# Altium schematic sheet ResDivider.SchDoc
size A3
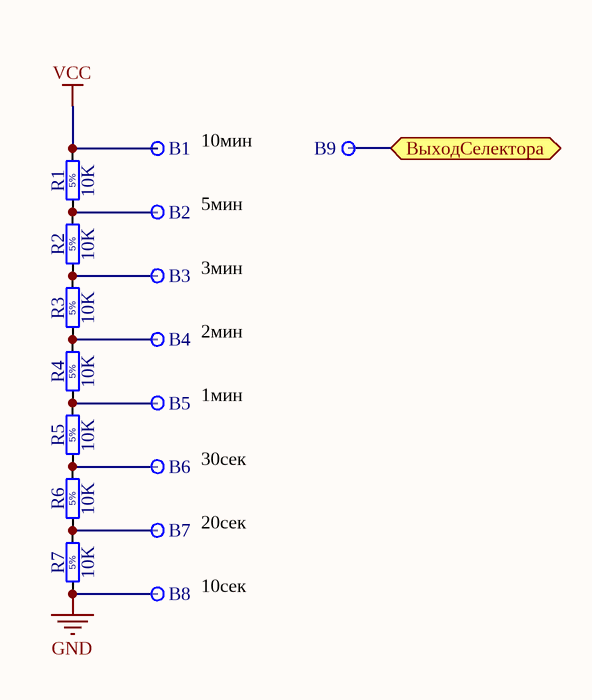
[diagram p0: ResDivider.SchDoc]

## Parts
B1  Plated Hole  [c180h130]  (value not drawn)
B2  Plated Hole  [c180h130]  (value not drawn)
B3  Plated Hole  [c180h130]  (value not drawn)
B4  Plated Hole  [c180h130]  (value not drawn)
B5  Plated Hole  [c180h130]  (value not drawn)
B6  Plated Hole  [c180h130]  (value not drawn)
B7  Plated Hole  [c180h130]  (value not drawn)
B8  Plated Hole  [c180h130]  (value not drawn)
B9  Plated Hole  [c180h130]  (value not drawn)
R1  10K  [RES_ARCOL_RCC025]
R2  10K  [RES_ARCOL_RCC025]
R3  10K  [RES_ARCOL_RCC025]
R4  10K  [RES_ARCOL_RCC025]
R5  10K  [RES_ARCOL_RCC025]
R6  10K  [RES_ARCOL_RCC025]
R7  10K  [RES_ARCOL_RCC025]

## Ports
ВыходСелектора

## Nets
GND: B8.1 R7.1
VCC: B1.1 R1.2
ВыходСелектора: B9.1 ; port ВыходСелектора
NetB2_1: B2.1 R1.1 R2.2
NetB3_1: B3.1 R2.1 R3.2
NetB4_1: B4.1 R3.1 R4.2
NetB5_1: B5.1 R4.1 R5.2
NetB6_1: B6.1 R5.1 R6.2
NetB7_1: B7.1 R6.1 R7.2

## Notes on the sheet
- 10мин
- 5мин
- 3мин
- 2мин
- 1мин
- 30сек
- 20сек
- 10сек
- (in symbol RCF_5K1_5%_0.25W_+10-6PPM_ARCOL_RCC025) 5%

## Library data of the parts
B1-B9 = PLATED_HOLE1.3_PAD1.8: Single Terminal Socket; Part Description: Plated Through Hole: Hole Dia.=1.3mm Pad Dia.=1.8mm; Mounted: No; Table: Pads; Part Number: PLATED_HOLE1.3_PAD1.8; Component Kind: Standard (No BOM); Component Type: Standard (No BOM); Pin Count: 1; Family: Plated Hole; Socket: No; SMD: No; Status: None; ComponentHeight: 0mm; Author: CERN DEM JLC; CreateDate: 30.10.2008; LatestRevisionDate: 30.10.2008; PackageDescription: Plated Through Hole: Hole Dia.=1.3mm Pad Dia.=1.8mm
R1-R7 = RCF_5K1_5%_0.25W_+10-6PPM_ARCOL_RCC025: Resistor - 5%; Part Description: Solid Carbon Resistor RCC Series; Manufacturer: ARCOL; Manufacturer Part Number: RCC025 5k1 J; Power: 0.25W; TC: +10-6ppm/°C; Table: Resistors THD; Part Number: RCF_5K1_5%_0.25W_+10-6PPM_ARCOL_RCC025; Component Kind: Standard; Component Type: Standard; Pin Count: 2; Value: 10K; Status: None; Tolerance: ±5%; Case: LS10.16 L6.3 x D2.4; Mounted: Yes; Socket: No; SMD: No; ComponentHeight: 2.5mm; HelpURL: \\cern.ch\dfs\Applications\Altium\Datasheets\RCF_ARCOL_RCC025.pdf; Author: CERN DEM JLC; CreateDate: 30.10.2013; LatestRevisionDate: 30.10.2013